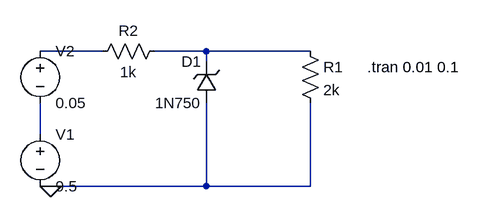
[diagram p0: schematic Draft35.asc]
Draft35.asc, the LTspice schematic file:
Version 4
SHEET 1 880 680
WIRE 240 240 144 240
WIRE 400 240 320 240
WIRE 560 240 400 240
WIRE 400 256 400 240
WIRE 144 368 144 320
WIRE 160 448 144 448
WIRE 400 448 400 320
WIRE 400 448 160 448
WIRE 560 448 560 320
WIRE 560 448 400 448
FLAG 160 448 0
SYMBOL voltage 144 352 R0
SYMATTR InstName V1
SYMATTR Value 9.5
SYMBOL voltage 144 224 R0
SYMATTR InstName V2
SYMATTR Value 0.05
SYMBOL zener 416 320 R180
WINDOW 0 24 64 Left 2
WINDOW 3 24 0 Left 2
SYMATTR InstName D1
SYMATTR Value 1N750
SYMBOL res 544 224 R0
SYMATTR InstName R1
SYMATTR Value 2k
SYMBOL res 336 224 R90
WINDOW 0 0 56 VBottom 2
WINDOW 3 32 56 VTop 2
SYMATTR InstName R2
SYMATTR Value 1k
TEXT 648 264 Left 2 !.tran 0.01 0.1

The netlist it stands for:
* Draft35.asc
V1 N003 0 9.5
V2 N001 N003 0.05
D1 0 N002 1N750
R1 N002 0 2k
R2 N002 N001 1k
.model D D
.lib standard.dio
.tran 0.01 0.1
.backanno
.end